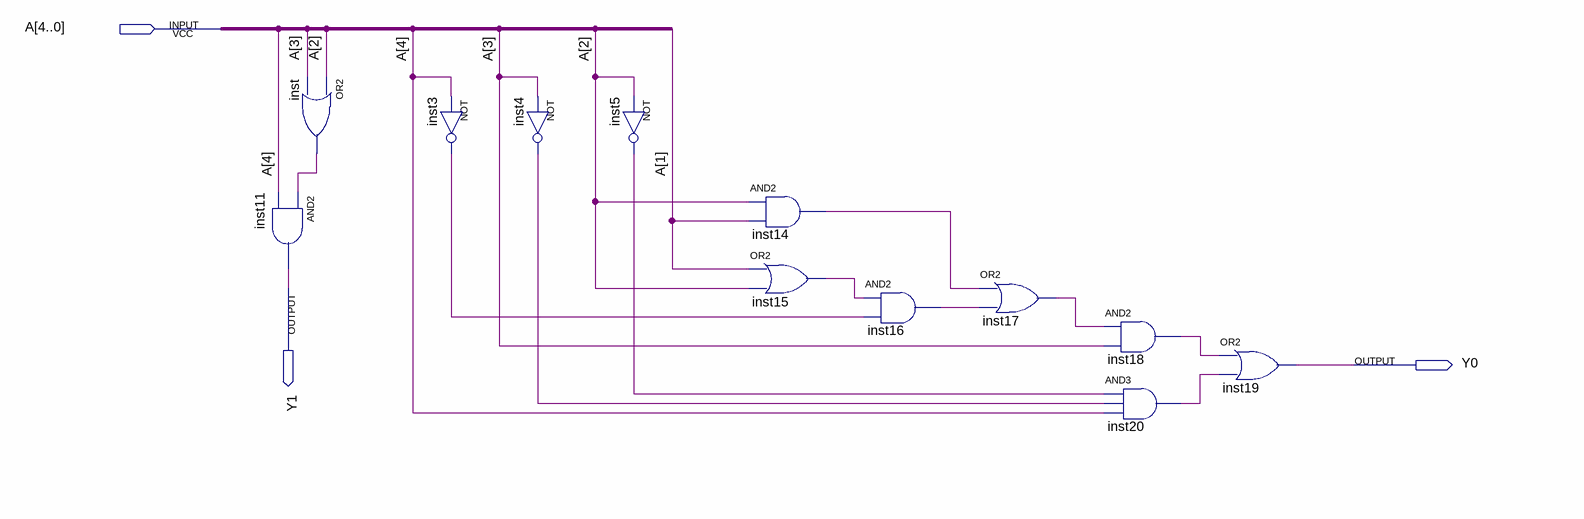
[diagram p0: schematic sheet]
// Quartus schematic detector_01010_10100_11110.bdf as structural Verilog: 12 symbols, 3 pins
module detector_01010_10100_11110 (
  input  [4:0] A,
  output Y1,
  output Y0
);

  wire inst3_out, inst4_out, inst5_out, inst14_out, inst15_out, inst16_out, inst17_out, inst18_out,
       inst20_out, inst_out;

  and inst11 (Y1, inst_out, A[4]);
  or inst (inst_out, A[2], A[3]);
  not inst3 (inst3_out, A[4]);
  not inst4 (inst4_out, A[3]);
  not inst5 (inst5_out, A[2]);
  and inst14 (inst14_out, A[2], A[1]);
  or inst15 (inst15_out, A[1], A[2]);
  and inst16 (inst16_out, inst15_out, inst3_out);
  or inst17 (inst17_out, inst14_out, inst16_out);
  and inst18 (inst18_out, inst17_out, A[3]);
  and inst20 (inst20_out, inst5_out, inst4_out, A[4]);
  or inst19 (Y0, inst18_out, inst20_out);
endmodule
